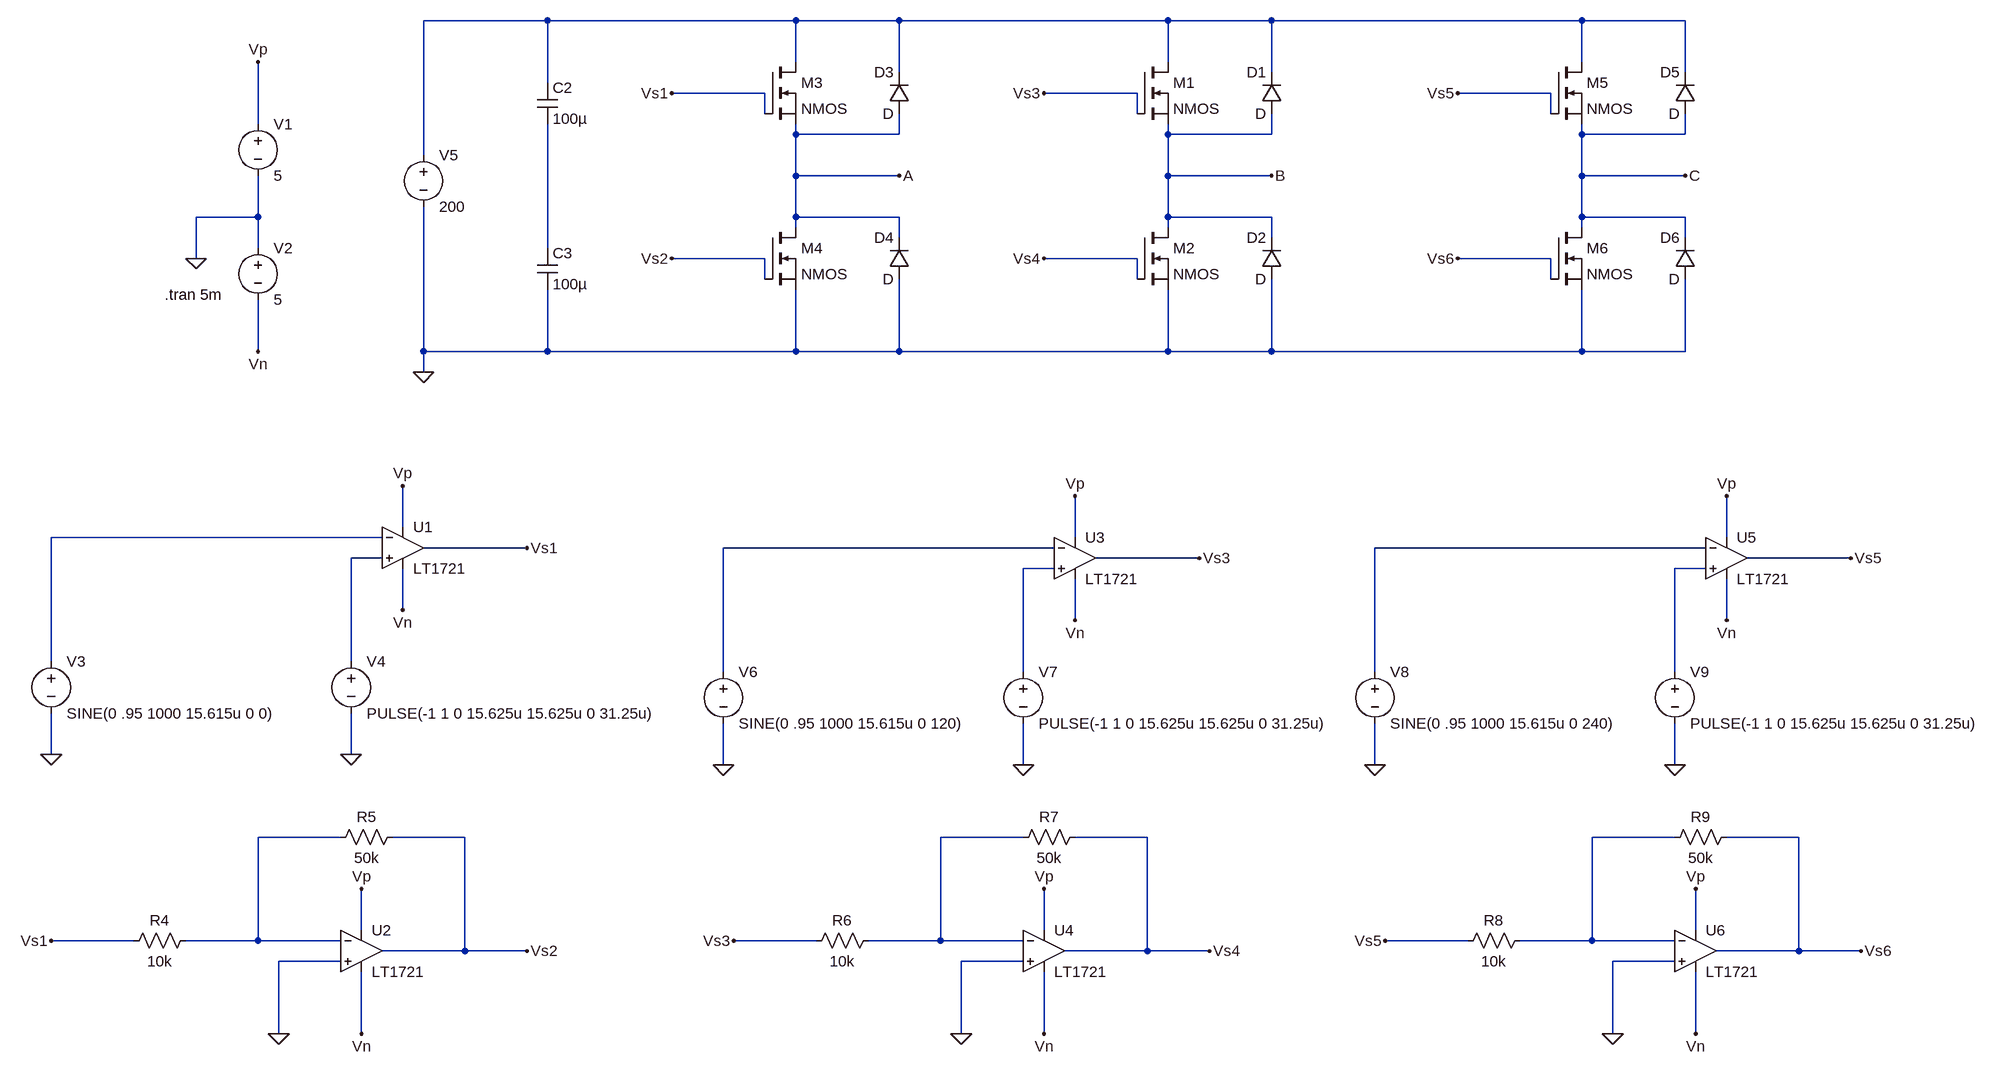
[diagram p0: schematic Three-Phase Inverter.asc]
Three-Phase Inverter.asc, the LTspice schematic file:
Version 4.1
SHEET 1 3348 756
WIRE 1056 -944 864 -944
WIRE 1440 -944 1056 -944
WIRE 1600 -944 1440 -944
WIRE 2016 -944 1600 -944
WIRE 2176 -944 2016 -944
WIRE 2656 -944 2176 -944
WIRE 2816 -944 2656 -944
WIRE 1440 -880 1440 -944
WIRE 2016 -880 2016 -944
WIRE 2656 -880 2656 -944
WIRE 1600 -864 1600 -944
WIRE 2176 -864 2176 -944
WIRE 2816 -864 2816 -944
WIRE 1056 -848 1056 -944
WIRE 1392 -832 1248 -832
WIRE 1968 -832 1824 -832
WIRE 2608 -832 2464 -832
WIRE 1392 -800 1392 -832
WIRE 1968 -800 1968 -832
WIRE 2608 -800 2608 -832
WIRE 608 -784 608 -880
WIRE 1440 -768 1440 -784
WIRE 1600 -768 1600 -800
WIRE 1600 -768 1440 -768
WIRE 2016 -768 2016 -784
WIRE 2176 -768 2176 -800
WIRE 2176 -768 2016 -768
WIRE 2656 -768 2656 -784
WIRE 2816 -768 2816 -800
WIRE 2816 -768 2656 -768
WIRE 864 -736 864 -944
WIRE 1440 -704 1440 -768
WIRE 1600 -704 1440 -704
WIRE 2016 -704 2016 -768
WIRE 2176 -704 2016 -704
WIRE 2656 -704 2656 -768
WIRE 2816 -704 2656 -704
WIRE 608 -640 608 -704
WIRE 608 -640 512 -640
WIRE 1440 -640 1440 -704
WIRE 1600 -640 1440 -640
WIRE 2016 -640 2016 -704
WIRE 2176 -640 2016 -640
WIRE 2656 -640 2656 -704
WIRE 2816 -640 2656 -640
WIRE 1440 -624 1440 -640
WIRE 2016 -624 2016 -640
WIRE 2656 -624 2656 -640
WIRE 1600 -608 1600 -640
WIRE 2176 -608 2176 -640
WIRE 2816 -608 2816 -640
WIRE 608 -592 608 -640
WIRE 1056 -592 1056 -784
WIRE 512 -576 512 -640
WIRE 1392 -576 1248 -576
WIRE 1968 -576 1824 -576
WIRE 2608 -576 2464 -576
WIRE 1392 -544 1392 -576
WIRE 1968 -544 1968 -576
WIRE 2608 -544 2608 -576
WIRE 608 -432 608 -512
WIRE 864 -432 864 -656
WIRE 1056 -432 1056 -528
WIRE 1056 -432 864 -432
WIRE 1440 -432 1440 -528
WIRE 1440 -432 1056 -432
WIRE 1600 -432 1600 -544
WIRE 1600 -432 1440 -432
WIRE 2016 -432 2016 -528
WIRE 2016 -432 1600 -432
WIRE 2176 -432 2176 -544
WIRE 2176 -432 2016 -432
WIRE 2656 -432 2656 -528
WIRE 2656 -432 2176 -432
WIRE 2816 -432 2816 -544
WIRE 2816 -432 2656 -432
WIRE 864 -400 864 -432
WIRE 832 -160 832 -224
WIRE 800 -144 288 -144
WIRE 1872 -144 1872 -208
WIRE 2880 -144 2880 -208
WIRE 1024 -128 864 -128
WIRE 1840 -128 1328 -128
WIRE 2848 -128 2336 -128
WIRE 800 -112 752 -112
WIRE 2064 -112 1904 -112
WIRE 3072 -112 2912 -112
WIRE 1840 -96 1792 -96
WIRE 2848 -96 2800 -96
WIRE 832 -32 832 -96
WIRE 1872 -16 1872 -80
WIRE 2880 -16 2880 -80
WIRE 288 48 288 -144
WIRE 752 48 752 -112
WIRE 1328 64 1328 -128
WIRE 1792 64 1792 -96
WIRE 2336 64 2336 -128
WIRE 2800 64 2800 -96
WIRE 288 192 288 128
WIRE 752 192 752 128
WIRE 1328 208 1328 144
WIRE 1792 208 1792 144
WIRE 2336 208 2336 144
WIRE 2800 208 2800 144
WIRE 736 320 608 320
WIRE 928 320 816 320
WIRE 1792 320 1664 320
WIRE 1984 320 1872 320
WIRE 2800 320 2672 320
WIRE 2992 320 2880 320
WIRE 768 464 768 400
WIRE 1824 464 1824 400
WIRE 2832 464 2832 400
WIRE 416 480 288 480
WIRE 608 480 608 320
WIRE 608 480 496 480
WIRE 736 480 608 480
WIRE 1472 480 1344 480
WIRE 1664 480 1664 320
WIRE 1664 480 1552 480
WIRE 1792 480 1664 480
WIRE 2480 480 2352 480
WIRE 2672 480 2672 320
WIRE 2672 480 2560 480
WIRE 2800 480 2672 480
WIRE 928 496 928 320
WIRE 928 496 800 496
WIRE 1024 496 928 496
WIRE 1984 496 1984 320
WIRE 1984 496 1856 496
WIRE 2080 496 1984 496
WIRE 2992 496 2992 320
WIRE 2992 496 2864 496
WIRE 3088 496 2992 496
WIRE 736 512 640 512
WIRE 1792 512 1696 512
WIRE 2800 512 2704 512
WIRE 640 624 640 512
WIRE 768 624 768 528
WIRE 1696 624 1696 512
WIRE 1824 624 1824 528
WIRE 2704 624 2704 512
WIRE 2832 624 2832 528
FLAG 512 -576 0
FLAG 608 -880 Vp
FLAG 608 -432 Vn
FLAG 288 192 0
FLAG 752 192 0
FLAG 832 -224 Vp
FLAG 832 -32 Vn
FLAG 1024 -128 Vs1
FLAG 864 -400 0
FLAG 1824 -832 Vs3
FLAG 1824 -576 Vs4
FLAG 1248 -832 Vs1
FLAG 1248 -576 Vs2
FLAG 1328 208 0
FLAG 1792 208 0
FLAG 1872 -208 Vp
FLAG 1872 -16 Vn
FLAG 2064 -112 Vs3
FLAG 2336 208 0
FLAG 2800 208 0
FLAG 2880 -208 Vp
FLAG 2880 -16 Vn
FLAG 3072 -112 Vs5
FLAG 2464 -832 Vs5
FLAG 2464 -576 Vs6
FLAG 1600 -704 A
FLAG 2176 -704 B
FLAG 2816 -704 C
FLAG 288 480 Vs1
FLAG 640 624 0
FLAG 1024 496 Vs2
FLAG 768 400 Vp
FLAG 768 624 Vn
FLAG 1344 480 Vs3
FLAG 1696 624 0
FLAG 2080 496 Vs4
FLAG 1824 400 Vp
FLAG 1824 624 Vn
FLAG 2352 480 Vs5
FLAG 2704 624 0
FLAG 3088 496 Vs6
FLAG 2832 400 Vp
FLAG 2832 624 Vn
SYMBOL voltage 608 -800 R0
WINDOW 123 0 0 Left 0
WINDOW 39 0 0 Left 0
SYMATTR InstName V1
SYMATTR Value 5
SYMBOL voltage 608 -608 R0
WINDOW 123 0 0 Left 0
WINDOW 39 0 0 Left 0
SYMATTR InstName V2
SYMATTR Value 5
SYMBOL Comparators\\LT1721 832 -192 R0
SYMATTR InstName U1
SYMBOL voltage 288 32 R0
WINDOW 123 0 0 Left 0
WINDOW 39 0 0 Left 0
SYMATTR InstName V3
SYMATTR Value SINE(0 .95 1000 15.615u 0 0)
SYMBOL voltage 752 32 R0
WINDOW 123 0 0 Left 0
WINDOW 39 0 0 Left 0
SYMATTR InstName V4
SYMATTR Value PULSE(-1 1 0 15.625u 15.625u 0 31.25u)
SYMBOL voltage 864 -752 R0
WINDOW 123 0 0 Left 0
WINDOW 39 0 0 Left 0
SYMATTR InstName V5
SYMATTR Value 200
SYMBOL cap 1040 -848 R0
SYMATTR InstName C2
SYMATTR Value 100µ
SYMBOL cap 1040 -592 R0
SYMATTR InstName C3
SYMATTR Value 100µ
SYMBOL nmos 1968 -880 R0
SYMATTR InstName M1
SYMBOL nmos 1968 -624 R0
SYMATTR InstName M2
SYMBOL diode 2192 -800 R180
WINDOW 0 24 64 Left 2
WINDOW 3 24 0 Left 2
SYMATTR InstName D1
SYMBOL diode 2192 -544 R180
WINDOW 0 24 64 Left 2
WINDOW 3 24 0 Left 2
SYMATTR InstName D2
SYMBOL nmos 1392 -880 R0
SYMATTR InstName M3
SYMBOL nmos 1392 -624 R0
SYMATTR InstName M4
SYMBOL diode 1616 -800 R180
WINDOW 0 24 64 Left 2
WINDOW 3 24 0 Left 2
SYMATTR InstName D3
SYMBOL diode 1616 -544 R180
WINDOW 0 24 64 Left 2
WINDOW 3 24 0 Left 2
SYMATTR InstName D4
SYMBOL Comparators\\LT1721 1872 -176 R0
SYMATTR InstName U3
SYMBOL voltage 1328 48 R0
WINDOW 123 0 0 Left 0
WINDOW 39 0 0 Left 0
SYMATTR InstName V6
SYMATTR Value SINE(0 .95 1000 15.615u 0 120)
SYMBOL voltage 1792 48 R0
WINDOW 123 0 0 Left 0
WINDOW 39 0 0 Left 0
SYMATTR InstName V7
SYMATTR Value PULSE(-1 1 0 15.625u 15.625u 0 31.25u)
SYMBOL Comparators\\LT1721 2880 -176 R0
SYMATTR InstName U5
SYMBOL voltage 2336 48 R0
WINDOW 123 0 0 Left 0
WINDOW 39 0 0 Left 0
SYMATTR InstName V8
SYMATTR Value SINE(0 .95 1000 15.615u 0 240)
SYMBOL voltage 2800 48 R0
WINDOW 123 0 0 Left 0
WINDOW 39 0 0 Left 0
SYMATTR InstName V9
SYMATTR Value PULSE(-1 1 0 15.625u 15.625u 0 31.25u)
SYMBOL nmos 2608 -880 R0
SYMATTR InstName M5
SYMBOL nmos 2608 -624 R0
SYMATTR InstName M6
SYMBOL diode 2832 -800 R180
WINDOW 0 24 64 Left 2
WINDOW 3 24 0 Left 2
SYMATTR InstName D5
SYMBOL diode 2832 -544 R180
WINDOW 0 24 64 Left 2
WINDOW 3 24 0 Left 2
SYMATTR InstName D6
SYMBOL Comparators\\LT1721 768 432 R0
SYMATTR InstName U2
SYMBOL res 512 464 R90
WINDOW 0 0 56 VBottom 2
WINDOW 3 32 56 VTop 2
SYMATTR InstName R4
SYMATTR Value 10k
SYMBOL res 832 304 R90
WINDOW 0 0 56 VBottom 2
WINDOW 3 32 56 VTop 2
SYMATTR InstName R5
SYMATTR Value 50k
SYMBOL Comparators\\LT1721 1824 432 R0
SYMATTR InstName U4
SYMBOL res 1568 464 R90
WINDOW 0 0 56 VBottom 2
WINDOW 3 32 56 VTop 2
SYMATTR InstName R6
SYMATTR Value 10k
SYMBOL res 1888 304 R90
WINDOW 0 0 56 VBottom 2
WINDOW 3 32 56 VTop 2
SYMATTR InstName R7
SYMATTR Value 50k
SYMBOL Comparators\\LT1721 2832 432 R0
SYMATTR InstName U6
SYMBOL res 2576 464 R90
WINDOW 0 0 56 VBottom 2
WINDOW 3 32 56 VTop 2
SYMATTR InstName R8
SYMATTR Value 10k
SYMBOL res 2896 304 R90
WINDOW 0 0 56 VBottom 2
WINDOW 3 32 56 VTop 2
SYMATTR InstName R9
SYMATTR Value 50k
TEXT 464 -520 Left 2 !.tran 5m

The netlist it stands for:
* Three-Phase Inverter.asc
V1 Vp 0 5
V2 0 Vn 5
X§U1 N006 N003 Vp Vn Vs1 LT1720  ; LT1721, pins In+ In- V+ V- OUT
V3 N003 0 SINE(0 .95 1000 15.615u 0 0)
V4 N006 0 PULSE(-1 1 0 15.625u 15.625u 0 31.25u)
V5 N001 0 200
C2 N001 N002 100µ
C3 N002 0 100µ
M1 N001 Vs3 B B NMOS
M2 B Vs4 0 0 NMOS
D1 B N001 D
D2 0 B D
M3 N001 Vs1 A A NMOS
M4 A Vs2 0 0 NMOS
D3 A N001 D
D4 0 A D
X§U3 N007 N004 Vp Vn Vs3 LT1720  ; LT1721, pins In+ In- V+ V- OUT
V6 N004 0 SINE(0 .95 1000 15.615u 0 120)
V7 N007 0 PULSE(-1 1 0 15.625u 15.625u 0 31.25u)
X§U5 N008 N005 Vp Vn Vs5 LT1720  ; LT1721, pins In+ In- V+ V- OUT
V8 N005 0 SINE(0 .95 1000 15.615u 0 240)
V9 N008 0 PULSE(-1 1 0 15.625u 15.625u 0 31.25u)
M5 N001 Vs5 C C NMOS
M6 C Vs6 0 0 NMOS
D5 C N001 D
D6 0 C D
X§U2 0 N009 Vp Vn Vs2 LT1720  ; LT1721, pins In+ In- V+ V- OUT
R4 N009 Vs1 10k
R5 Vs2 N009 50k
X§U4 0 N010 Vp Vn Vs4 LT1720  ; LT1721, pins In+ In- V+ V- OUT
R6 N010 Vs3 10k
R7 Vs4 N010 50k
X§U6 0 N011 Vp Vn Vs6 LT1720  ; LT1721, pins In+ In- V+ V- OUT
R8 N011 Vs5 10k
R9 Vs6 N011 50k
.model D D
.lib standard.dio
.model NMOS NMOS
.model PMOS PMOS
.lib standard.mos
.tran 5m
.lib LTC.lib
.backanno
.end